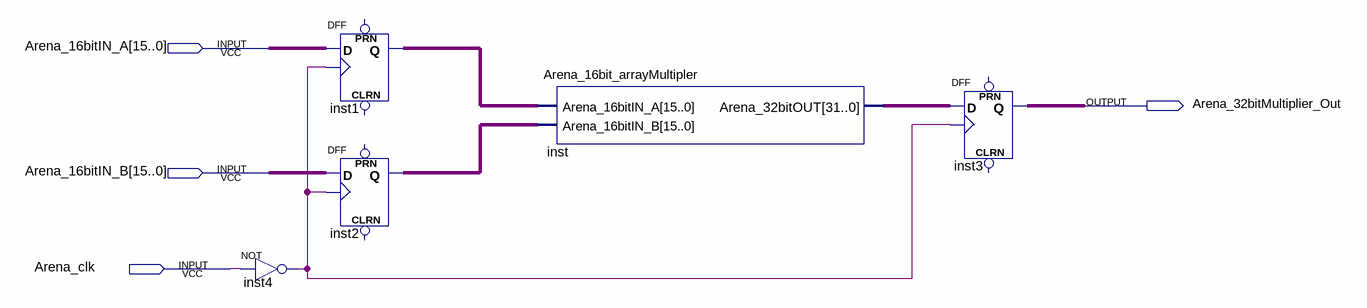
[diagram p0: schematic sheet]
// Quartus schematic Arena_16bitMuliplier_using_registers_v1.bdf as structural Verilog: 5 symbols, 4 pins
module Arena_16bitMuliplier_using_registers_v1 (
  input  [15:0] Arena_16bitIN_A,
  input  [15:0] Arena_16bitIN_B,
  input  Arena_clk,
  output Arena_32bitMultiplier_Out
);

  wire inst4_out;
  wire [15:0] inst1_q, inst2_q;
  wire [31:0] inst3_q, inst_arena_32bitout;

  not inst4 (inst4_out, Arena_clk);
  DFF inst1[15:0] (.CLK(inst4_out), .D(Arena_16bitIN_A), .Q(inst1_q));  // open: CLRN, PRN
  DFF inst2[15:0] (.CLK(inst4_out), .D(Arena_16bitIN_B), .Q(inst2_q));  // open: CLRN, PRN
  Arena_16bit_arrayMultipler inst (
    .Arena_16bitIN_A(inst1_q), .Arena_16bitIN_B(inst2_q), .Arena_32bitOUT(inst_arena_32bitout));
  DFF inst3[31:0] (.CLK(inst4_out), .D(inst_arena_32bitout), .Q(inst3_q));  // open: CLRN, PRN
endmodule
